# EAGLE schematic Bolt-On Template (EAGLE 9.6.2)
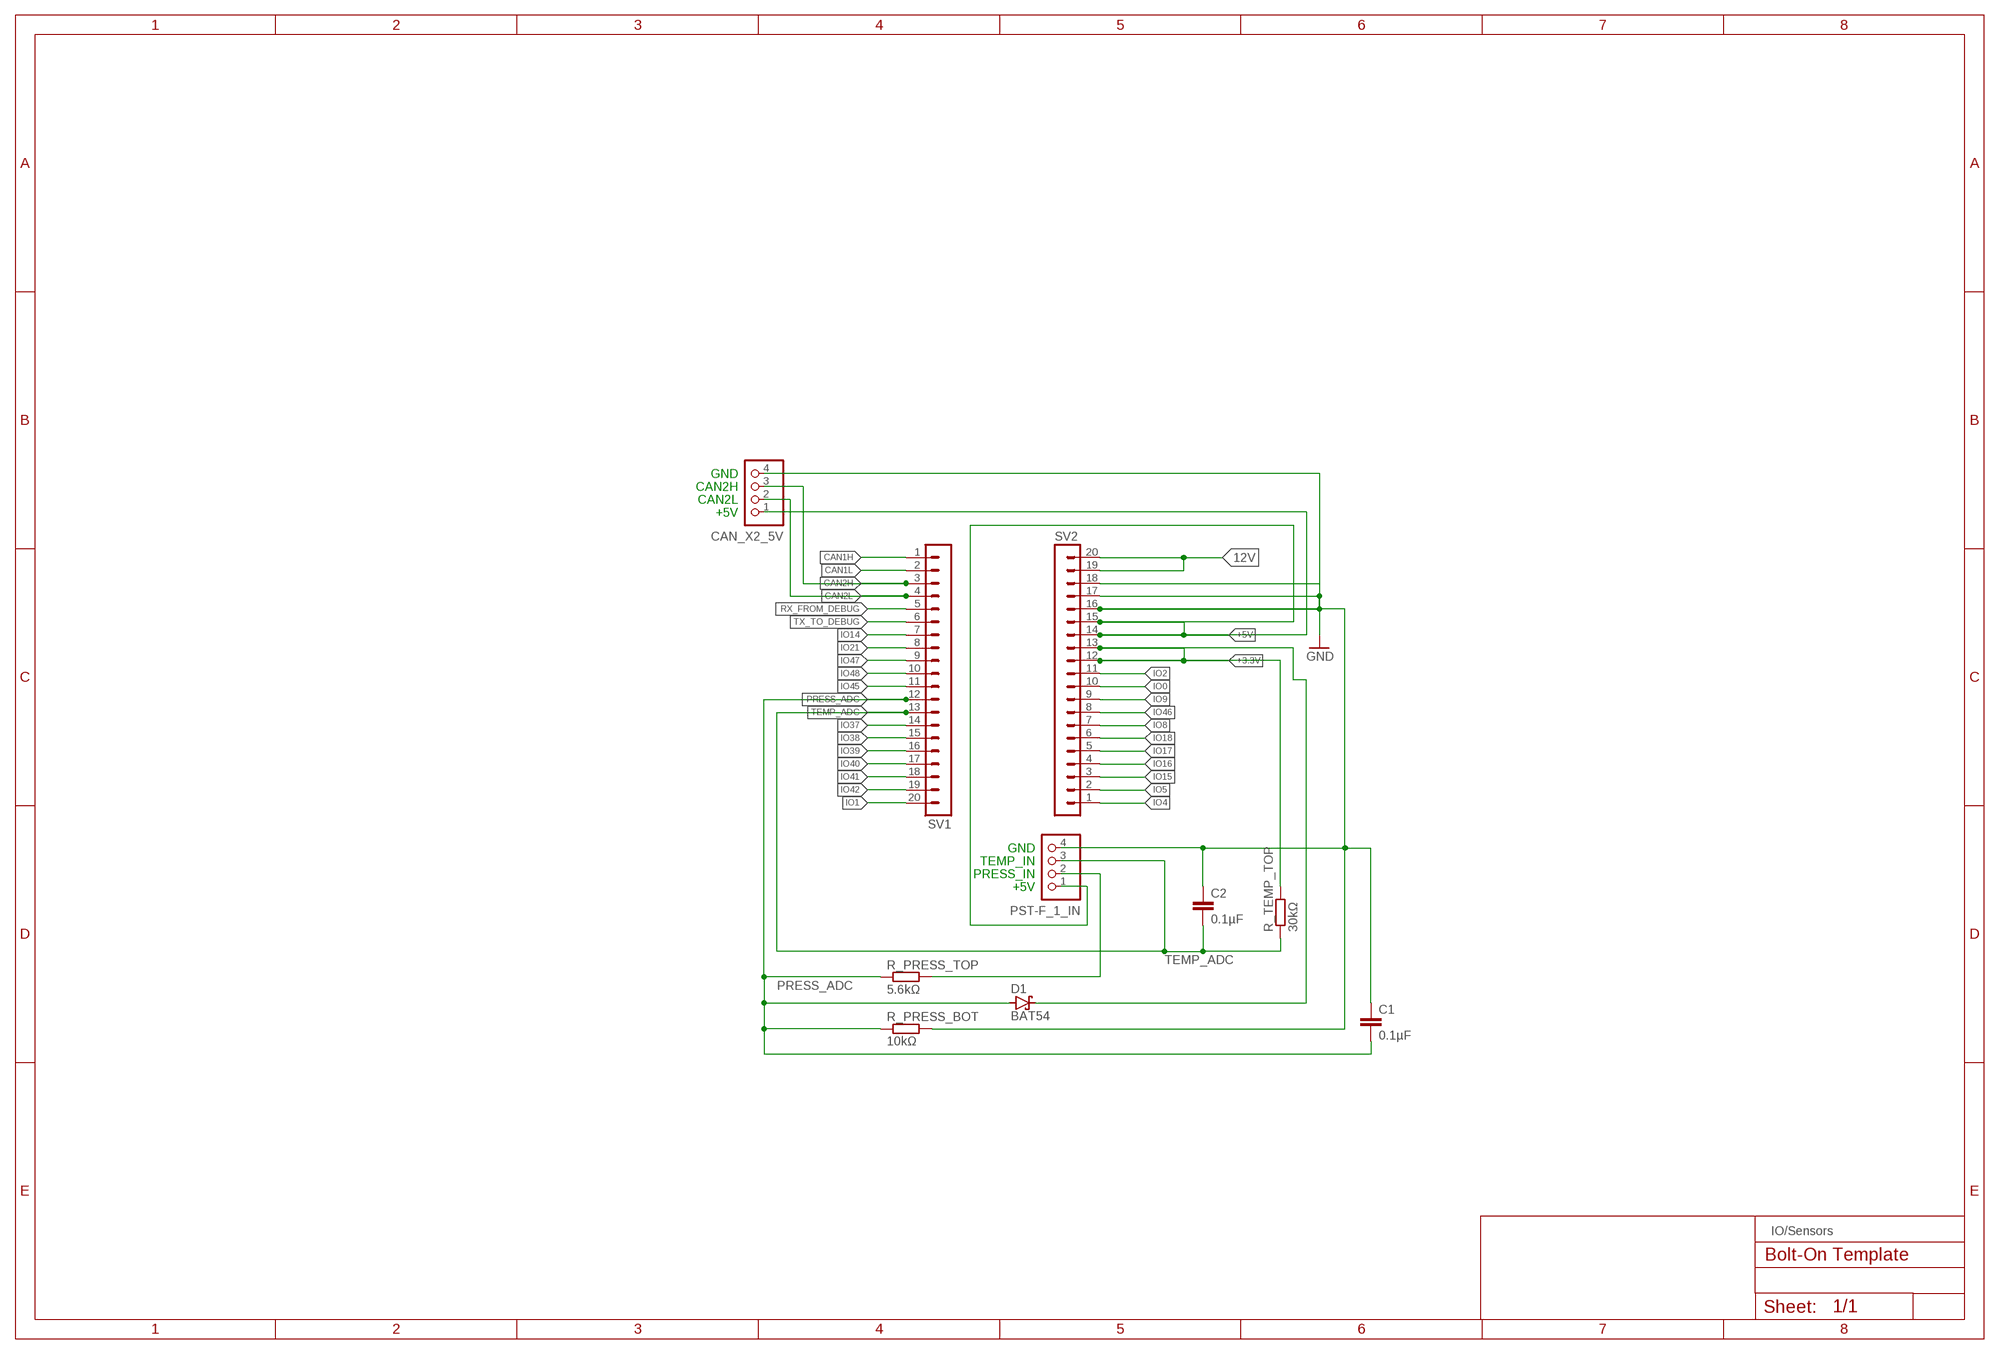
[diagram p0: schematic, sheet 1]

## Parts
C1  0.1µF  C-EUC0805  [C0805]
C2  0.1µF  C-EUC0805  [C0805]
CAN_X2_5V  S4B-PH-K-S  [S4B-PH-K-S]
D1  BAT54  [SOT23]
PST-F_1_IN  S4B-PH-K-S  [S4B-PH-K-S]
R_PRESS_BOT  10kΩ  R-EU_R0805  [R0805]
R_PRESS_TOP  5.6kΩ  R-EU_R0805  [R0805]
R_TEMP_TOP  30kΩ  R-EU_R0805  [R0805]
SV1  MA20-1L  [MA20-1L]
SV2  MA20-1L  [MA20-1L]

## Nets
12V: SV2.19 SV2.20
+3.3V: D1.3(C) R_TEMP_TOP.2 SV2.12 SV2.13
+5V: CAN_X2_5V.1 PST-F_1_IN.1 SV2.14 SV2.15
CAN1H: SV1.1
CAN1L: SV1.2
CAN2H: CAN_X2_5V.3 SV1.3
CAN2L: CAN_X2_5V.2 SV1.4
GND: C1.1 C2.1 CAN_X2_5V.4 PST-F_1_IN.4 R_PRESS_BOT.2 SV2.16 SV2.17 SV2.18
IO0: SV2.10
IO1: SV1.20
IO2: SV2.11
IO4: SV2.1
IO5: SV2.2
IO8: SV2.7
IO9: SV2.9
IO14: SV1.7
IO15: SV2.3
IO16: SV2.4
IO17: SV2.5
IO18: SV2.6
IO21: SV1.8
IO37: SV1.14
IO38: SV1.15
IO39: SV1.16
IO40: SV1.17
IO41: SV1.18
IO42: SV1.19
IO45: SV1.11
IO46: SV2.8
IO47: SV1.9
IO48: SV1.10
N$1: PST-F_1_IN.2 R_PRESS_TOP.2
PRESS_ADC: C1.2 D1.1(A) R_PRESS_BOT.1 R_PRESS_TOP.1 SV1.12
RX_FROM_DEBUG: SV1.5
TEMP_ADC: C2.2 PST-F_1_IN.3 R_TEMP_TOP.1 SV1.13
TX_TO_DEBUG: SV1.6

## Notes on the sheet
- GND
- CAN2H
- CAN2L
- +5V
- GND
- TEMP_IN
- PRESS_IN
- +5V
- IO/Sensors

## Library data of the parts
C1 C2 = rcl:C-EU: CAPACITOR, European symbol; SPICEPREFIX: C
CAN_X2_5V PST-F_1_IN = JST PH Library:S4B-PH-*: Wire-to-Board 2.0mm pitch side mount connector Source: http://www.jst-mfg.com/product/pdf/jpn/PH.pdf http://www.jst-mfg.com/product/detail.php?series=199
D1 = diode:BAT54: Schottky Diodes Source: Fairchild .. BAT54.pdf
R_PRESS_BOT R_PRESS_TOP R_TEMP_TOP = rcl:R-EU_: RESISTOR, European symbol; SPICEPREFIX: R
SV1 SV2 = con-lstb:MA20-1L: PIN HEADER; OC_FARNELL: unknown; OC_NEWARK: unknown